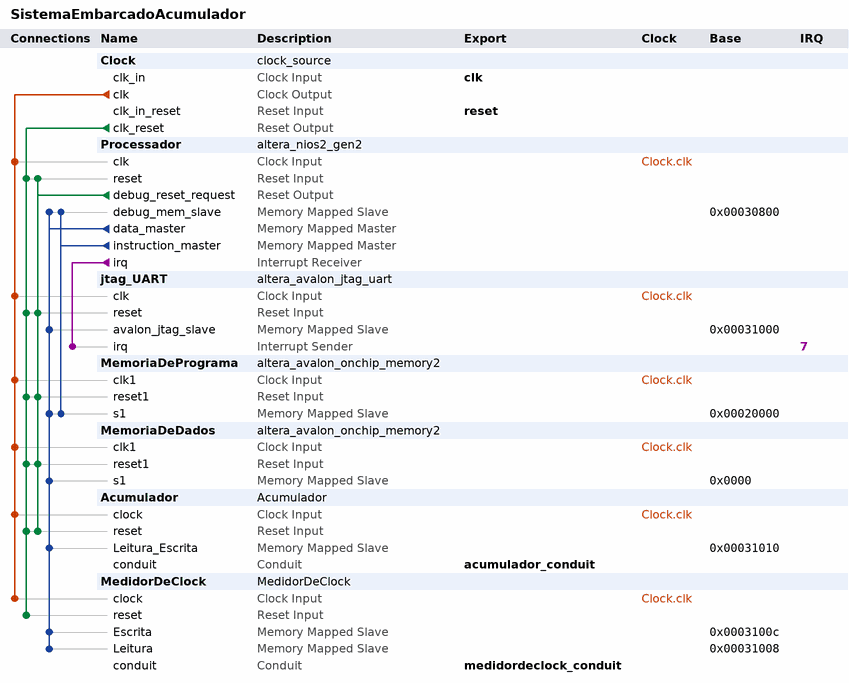
[diagram p0: system contents]
# Platform Designer (Qsys) system SistemaEmbarcadoAcumulador, Cyclone IV E EP4CE115F29C7
# Parameters at their usual value, and those the tool derives, are not listed.
package require -exact qsys 18.1
create_system SistemaEmbarcadoAcumulador
set_project_property DEVICE_FAMILY {Cyclone IV E}
set_project_property DEVICE EP4CE115F29C7

add_instance Clock clock_source 18.1
set_instance_parameter_value Clock clockFrequency 50000000

add_instance Processador altera_nios2_gen2 18.1
set_instance_parameter_value Processador dcache_size 2048
set_instance_parameter_value Processador exceptionSlave MemoriaDePrograma.s1
set_instance_parameter_value Processador icache_size 4096
set_instance_parameter_value Processador impl Tiny
set_instance_parameter_value Processador resetSlave MemoriaDePrograma.s1

add_instance jtag_UART altera_avalon_jtag_uart 18.1
set_instance_parameter_value jtag_UART simInteractiveOptions NO_INTERACTIVE_WINDOWS

add_instance MemoriaDePrograma altera_avalon_onchip_memory2 18.1
set_instance_parameter_value MemoriaDePrograma dataWidth 32
set_instance_parameter_value MemoriaDePrograma dualPort false
set_instance_parameter_value MemoriaDePrograma initMemContent true
set_instance_parameter_value MemoriaDePrograma initializationFileName onchip_mem.hex
set_instance_parameter_value MemoriaDePrograma memorySize 65536

add_instance MemoriaDeDados altera_avalon_onchip_memory2 18.1
set_instance_parameter_value MemoriaDeDados allowInSystemMemoryContentEditor true
set_instance_parameter_value MemoriaDeDados dataWidth 32
set_instance_parameter_value MemoriaDeDados dualPort false
set_instance_parameter_value MemoriaDeDados initMemContent true
set_instance_parameter_value MemoriaDeDados initializationFileName /home/erick/Sync/UFBA/ENGG52-Lab_1/Projetos/Quartus/AcumuladorNIOS/DadosDaMemoria.mif
set_instance_parameter_value MemoriaDeDados memorySize 65536
set_instance_parameter_value MemoriaDeDados useNonDefaultInitFile true
set_instance_parameter_value MemoriaDeDados writable false

add_instance Acumulador Acumulador 1.0

add_instance MedidorDeClock MedidorDeClock 1.0

# connections
add_connection Clock.clk Acumulador.clock clock
add_connection Clock.clk jtag_UART.clk clock
add_connection Clock.clk MedidorDeClock.clock clock
add_connection Clock.clk MemoriaDeDados.clk1 clock
add_connection Clock.clk MemoriaDePrograma.clk1 clock
add_connection Clock.clk Processador.clk clock
add_connection Clock.clk_reset Acumulador.reset reset
add_connection Clock.clk_reset jtag_UART.reset reset
add_connection Clock.clk_reset MedidorDeClock.reset reset
add_connection Clock.clk_reset MemoriaDeDados.reset1 reset
add_connection Clock.clk_reset MemoriaDePrograma.reset1 reset
add_connection Clock.clk_reset Processador.reset reset
add_connection Processador.debug_reset_request Acumulador.reset reset
add_connection Processador.debug_reset_request jtag_UART.reset reset
add_connection Processador.debug_reset_request MemoriaDeDados.reset1 reset
add_connection Processador.debug_reset_request MemoriaDePrograma.reset1 reset
add_connection Processador.debug_reset_request Processador.reset reset
add_connection Processador.data_master Acumulador.Leitura_Escrita avalon
set_connection_parameter_value Processador.data_master/Acumulador.Leitura_Escrita baseAddress 0x00031010
add_connection Processador.data_master jtag_UART.avalon_jtag_slave avalon
set_connection_parameter_value Processador.data_master/jtag_UART.avalon_jtag_slave baseAddress 0x00031000
add_connection Processador.data_master MedidorDeClock.Escrita avalon
set_connection_parameter_value Processador.data_master/MedidorDeClock.Escrita baseAddress 0x0003100c
add_connection Processador.data_master MedidorDeClock.Leitura avalon
set_connection_parameter_value Processador.data_master/MedidorDeClock.Leitura baseAddress 0x00031008
add_connection Processador.data_master MemoriaDeDados.s1 avalon
set_connection_parameter_value Processador.data_master/MemoriaDeDados.s1 baseAddress 0x0000
add_connection Processador.data_master MemoriaDePrograma.s1 avalon
set_connection_parameter_value Processador.data_master/MemoriaDePrograma.s1 baseAddress 0x00020000
add_connection Processador.data_master Processador.debug_mem_slave avalon
set_connection_parameter_value Processador.data_master/Processador.debug_mem_slave baseAddress 0x00030800
add_connection Processador.instruction_master MemoriaDePrograma.s1 avalon
set_connection_parameter_value Processador.instruction_master/MemoriaDePrograma.s1 baseAddress 0x00020000
add_connection Processador.instruction_master Processador.debug_mem_slave avalon
set_connection_parameter_value Processador.instruction_master/Processador.debug_mem_slave baseAddress 0x00030800
add_connection Processador.irq jtag_UART.irq interrupt
set_connection_parameter_value Processador.irq/jtag_UART.irq irqNumber 7

# exported interfaces
add_interface acumulador_conduit conduit end
set_interface_property acumulador_conduit EXPORT_OF Acumulador.conduit
add_interface clk clock sink
set_interface_property clk EXPORT_OF Clock.clk_in
add_interface medidordeclock_conduit conduit end
set_interface_property medidordeclock_conduit EXPORT_OF MedidorDeClock.conduit
add_interface reset reset sink
set_interface_property reset EXPORT_OF Clock.clk_in_reset

set_interconnect_requirement {$system} qsys_mm.clockCrossingAdapter HANDSHAKE
set_interconnect_requirement {$system} qsys_mm.enableEccProtection FALSE
set_interconnect_requirement {$system} qsys_mm.insertDefaultSlave FALSE
set_interconnect_requirement {$system} qsys_mm.maxAdditionalLatency 1

save_system SistemaEmbarcadoAcumulador.qsys
